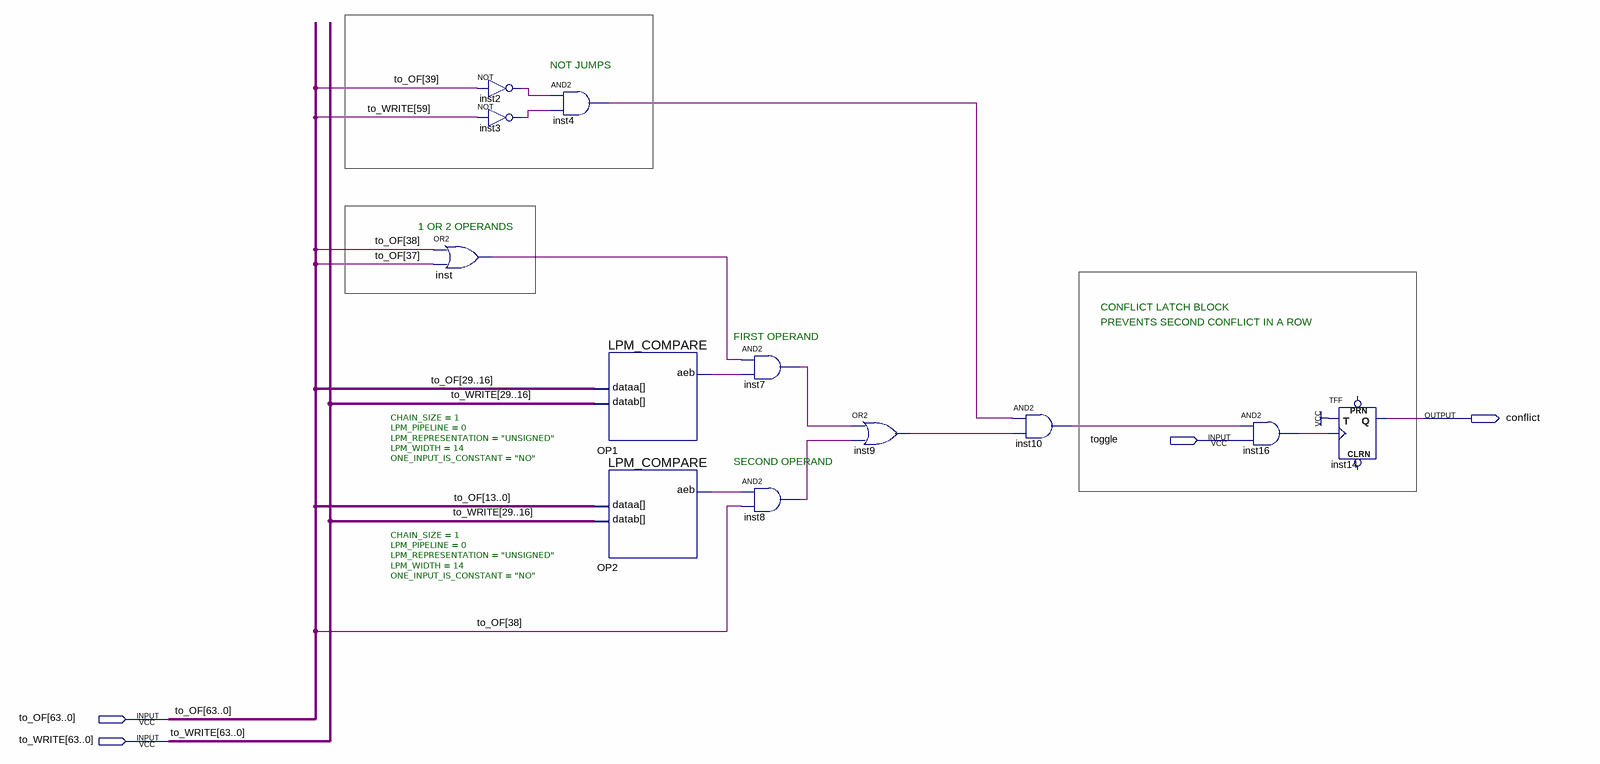
[diagram p0: schematic sheet]
// Quartus schematic read_write_conflict.bdf as structural Verilog: 12 symbols, 4 pins
module read_write_conflict (
  input  toggle,
  input  [63:0] to_OF,
  input  [63:0] to_WRITE,
  output conflict
);

  wire inst2_out, inst3_out, inst4_out, inst7_out, inst8_out, inst9_out, inst10_out, inst16_out, inst_out,
       OP1_aeb, OP2_aeb;

  or inst (inst_out, to_OF[38], to_OF[37]);
  not inst2 (inst2_out, to_OF[39]);
  not inst3 (inst3_out, to_WRITE[59]);
  and inst4 (inst4_out, inst2_out, inst3_out);
  LPM_COMPARE #(.CHAIN_SIZE(1), .LPM_PIPELINE(0), .LPM_REPRESENTATION("UNSIGNED"), .LPM_WIDTH(14), .ONE_INPUT_IS_CONSTANT("NO")) OP1 (
    .dataa(to_OF[29:16]), .datab(to_WRITE[29:16]), .aeb(OP1_aeb));
  LPM_COMPARE #(.CHAIN_SIZE(1), .LPM_PIPELINE(0), .LPM_REPRESENTATION("UNSIGNED"), .LPM_WIDTH(14), .ONE_INPUT_IS_CONSTANT("NO")) OP2 (
    .dataa(to_OF[13:0]), .datab(to_WRITE[29:16]), .aeb(OP2_aeb));
  and inst7 (inst7_out, inst_out, OP1_aeb);
  and inst8 (inst8_out, OP2_aeb, to_OF[38]);
  or inst9 (inst9_out, inst7_out, inst8_out);
  and inst10 (inst10_out, inst4_out, inst9_out);
  and inst16 (inst16_out, inst10_out, toggle);
  TFF inst14 (.T(1'b1), .CLK(inst16_out), .Q(conflict));  // open: PRN, CLRN

  // Notes on the sheet:
  //   NOT JUMPS
  //   1 OR 2 OPERANDS
  //   CONFLICT LATCH BLOCK
  //   PREVENTS SECOND CONFLICT IN A ROW
  //   FIRST OPERAND
  //   SECOND OPERAND
endmodule
